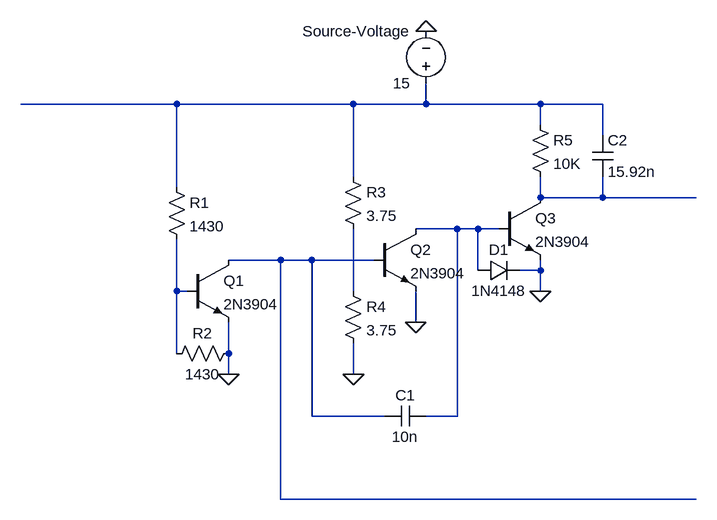
[diagram p0: schematic Project - 400100792.asc]
Project - 400100792.asc, the LTspice schematic file:
Version 4
SHEET 1 1236 680
WIRE 432 64 192 64
WIRE 704 64 432 64
WIRE 816 64 816 32
WIRE 816 64 704 64
WIRE 992 64 816 64
WIRE 1088 64 992 64
WIRE 992 96 992 64
WIRE 1088 112 1088 64
WIRE 704 176 704 64
WIRE 432 192 432 64
WIRE 992 208 992 176
WIRE 1088 208 1088 176
WIRE 1088 208 992 208
WIRE 1232 208 1088 208
WIRE 864 256 800 256
WIRE 896 256 864 256
WIRE 928 256 896 256
WIRE 592 304 512 304
WIRE 640 304 592 304
WIRE 736 304 640 304
WIRE 896 320 896 256
WIRE 992 320 992 304
WIRE 992 320 960 320
WIRE 432 352 432 272
WIRE 448 352 432 352
WIRE 704 352 704 256
WIRE 992 352 992 320
WIRE 800 400 800 352
WIRE 432 448 432 352
WIRE 512 448 512 400
WIRE 512 480 512 448
WIRE 704 480 704 432
WIRE 640 544 640 304
WIRE 752 544 640 544
WIRE 864 544 864 256
WIRE 864 544 816 544
WIRE 592 672 592 304
WIRE 1232 672 592 672
FLAG 512 480 0
FLAG 800 400 0
FLAG 992 352 0
FLAG 704 480 0
FLAG 816 -48 0
SYMBOL npn 448 304 R0
SYMATTR InstName Q1
SYMATTR Value 2N3904
SYMBOL res 416 176 R0
SYMATTR InstName R1
SYMATTR Value 1430
SYMBOL res 528 432 R90
WINDOW 0 0 56 VBottom 2
WINDOW 3 32 56 VTop 2
SYMATTR InstName R2
SYMATTR Value 1430
SYMBOL npn 736 256 R0
SYMATTR InstName Q2
SYMATTR Value 2N3904
SYMBOL npn 928 208 R0
SYMATTR InstName Q3
SYMATTR Value 2N3904
SYMBOL res 688 160 R0
SYMATTR InstName R3
SYMATTR Value 3.75
SYMBOL res 688 336 R0
SYMATTR InstName R4
SYMATTR Value 3.75
SYMBOL cap 816 528 R90
WINDOW 0 0 32 VBottom 2
WINDOW 3 32 32 VTop 2
SYMATTR InstName C1
SYMATTR Value 10n
SYMBOL diode 896 336 R270
WINDOW 0 32 32 VTop 2
WINDOW 3 0 32 VBottom 2
SYMATTR InstName D1
SYMATTR Value 1N4148
SYMBOL res 976 80 R0
SYMATTR InstName R5
SYMATTR Value 10K
SYMBOL cap 1072 112 R0
SYMATTR InstName C2
SYMATTR Value 15.92n
SYMBOL voltage 816 48 R180
WINDOW 0 24 96 Left 2
WINDOW 3 24 16 Left 2
SYMATTR InstName Source-Voltage
SYMATTR Value 15

The netlist it stands for:
* Project - 400100792.asc
Q1 N004 N005 0 0 2N3904
R1 N001 N005 1430
R2 0 N005 1430
Q2 N003 N004 0 0 2N3904
Q3 N002 N003 0 0 2N3904
R3 N001 N006 3.75
R4 N006 0 3.75
C1 N003 N004 10n
D1 N003 0 1N4148
R5 N001 N002 10K
C2 N001 N002 15.92n
V§Source-Voltage N001 0 15
.model D D
.lib standard.dio
.model NPN NPN
.model PNP PNP
.lib standard.bjt
.backanno
.end